# EAGLE schematic Shield (EAGLE 6.5.0)
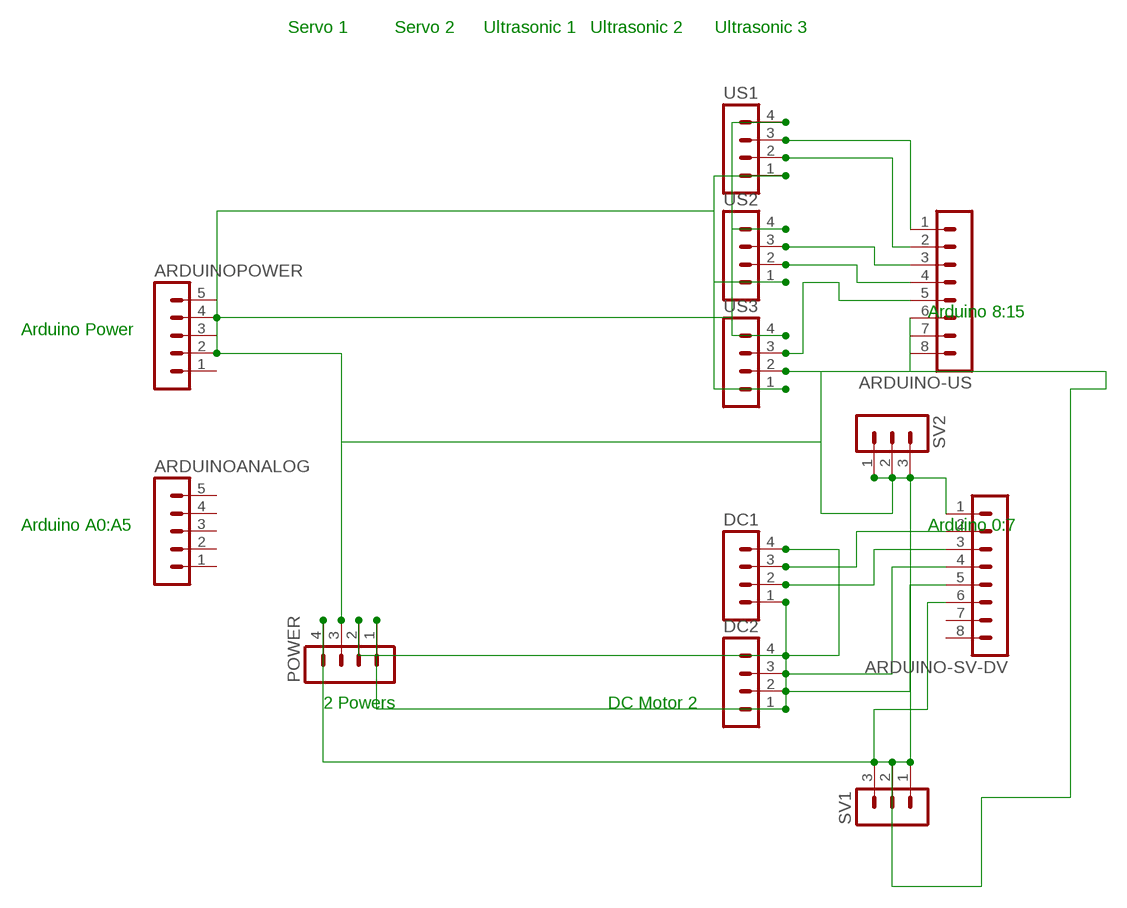
[diagram p0: schematic, sheet 1]

## Parts
ARDUINO-SV-DV  MA08-1W  [MA08-1W]
ARDUINO-US  MA08-1W  [MA08-1W]
ARDUINOANALOG  MA05-1  [MA05-1]
ARDUINOPOWER  MA05-1  [MA05-1]
DC1  MA04-1  [MA04-1]
DC2  MA04-1  [MA04-1]
POWER  MA04-1  [MA04-1]
SV1  MA03-1  [MA03-1]
SV2  MA03-1  [MA03-1]
US1  MA04-1  [MA04-1]
US2  MA04-1  [MA04-1]
US3  MA04-1  [MA04-1]

## Nets
DCG2: DC1.4 DC2.4 POWER.2
DCV2: DC1.1 DC2.1 POWER.1
N$8: ARDUINO-SV-DV.5 DC2.2
N$9: ARDUINO-SV-DV.4 DC2.3
N$15: ARDUINO-SV-DV.3 DC1.2
N$16: ARDUINO-SV-DV.2 DC1.3
N$22: ARDUINO-US.6 US3.2
N$23: ARDUINO-US.5 US3.3
N$26: ARDUINO-US.2 US1.2
N$27: ARDUINO-US.1 US1.3
N$30: ARDUINO-US.4 US2.2
N$31: ARDUINO-US.3 US2.3
SV2: POWER.4 SV1.1 SV2.1
SVPOWER: ARDUINO-SV-DV.6 SV1.3
SVPOWER2: ARDUINO-SV-DV.1 SV2.3
USG1: ARDUINOPOWER.2 POWER.3 SV1.2 SV2.2 US1.4 US2.4 US3.4
USP1: ARDUINOPOWER.4 US1.1 US2.1 US3.1
Unconnected: ARDUINO-SV-DV.7 ARDUINO-SV-DV.8 ARDUINO-US.7 ARDUINO-US.8 ARDUINOANALOG.1 ARDUINOANALOG.2 ARDUINOANALOG.3 ARDUINOANALOG.4 ARDUINOANALOG.5 ARDUINOPOWER.1 ARDUINOPOWER.3 ARDUINOPOWER.5

## Notes on the sheet
- Servo 1 | Servo 2 | Ultrasonic 1 | Ultrasonic 2 | Ultrasonic 3
- Arduino 8:15
- Arduino Power
- Arduino A0:A5 | Arduino 0:7
- 2 Powers | DC Motor 2

## Library data of the parts
ARDUINO-SV-DV ARDUINO-US = con-lstb:MA08-1W: PIN HEADER; OC_FARNELL: unknown; OC_NEWARK: unknown
ARDUINOANALOG ARDUINOPOWER = con-lstb:MA05-1: PIN HEADER; OC_FARNELL: unknown; OC_NEWARK: unknown
DC1 DC2 POWER US1-US3 = con-lstb:MA04-1: PIN HEADER; OC_FARNELL: unknown; OC_NEWARK: unknown
SV1 SV2 = con-lstb:MA03-1: PIN HEADER; OC_FARNELL: unknown; OC_NEWARK: unknown